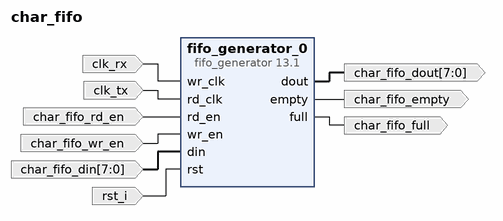
[diagram p0: block diagram of the top level]
# Vivado block design char_fifo, xc7z010clg400-1, Vivado 2017.2
create_bd_design char_fifo

create_bd_port -dir I -type clk clk_rx
create_bd_port -dir I -type clk clk_tx
create_bd_port -dir I char_fifo_rd_en
create_bd_port -dir O -from 7 -to 0 char_fifo_dout
create_bd_port -dir I char_fifo_wr_en
create_bd_port -dir I -from 7 -to 0 char_fifo_din
create_bd_port -dir O char_fifo_full
create_bd_port -dir I rst_i
create_bd_port -dir O char_fifo_empty

create_bd_cell -type ip -vlnv xilinx.com:ip:fifo_generator:13.1 fifo_generator_0
set_property -dict [list \
  CONFIG.Fifo_Implementation Independent_Clocks_Block_RAM \
  CONFIG.Input_Data_Width 8 \
  CONFIG.Output_Data_Width 8 \
  CONFIG.Full_Flags_Reset_Value 1 \
  CONFIG.Use_Dout_Reset true \
] [get_bd_cells fifo_generator_0]

# ---- connections ----

connect_bd_net -net wr_clk_1 [get_bd_ports clk_rx] [get_bd_pins fifo_generator_0/wr_clk]
connect_bd_net -net rd_clk_1 [get_bd_ports clk_tx] [get_bd_pins fifo_generator_0/rd_clk]
connect_bd_net -net rd_en_1 [get_bd_ports char_fifo_rd_en] [get_bd_pins fifo_generator_0/rd_en]
connect_bd_net [get_bd_pins fifo_generator_0/dout] [get_bd_ports char_fifo_dout]
connect_bd_net -net wr_en_1 [get_bd_ports char_fifo_wr_en] [get_bd_pins fifo_generator_0/wr_en]
connect_bd_net -net din_1 [get_bd_ports char_fifo_din] [get_bd_pins fifo_generator_0/din]
connect_bd_net [get_bd_pins fifo_generator_0/full] [get_bd_ports char_fifo_full]
connect_bd_net -net rst_1 [get_bd_ports rst_i] [get_bd_pins fifo_generator_0/rst]
connect_bd_net [get_bd_pins fifo_generator_0/empty] [get_bd_ports char_fifo_empty]

validate_bd_design
save_bd_design
